# EAGLE schematic Rocket32_TRASIO (EAGLE 9.6.2)
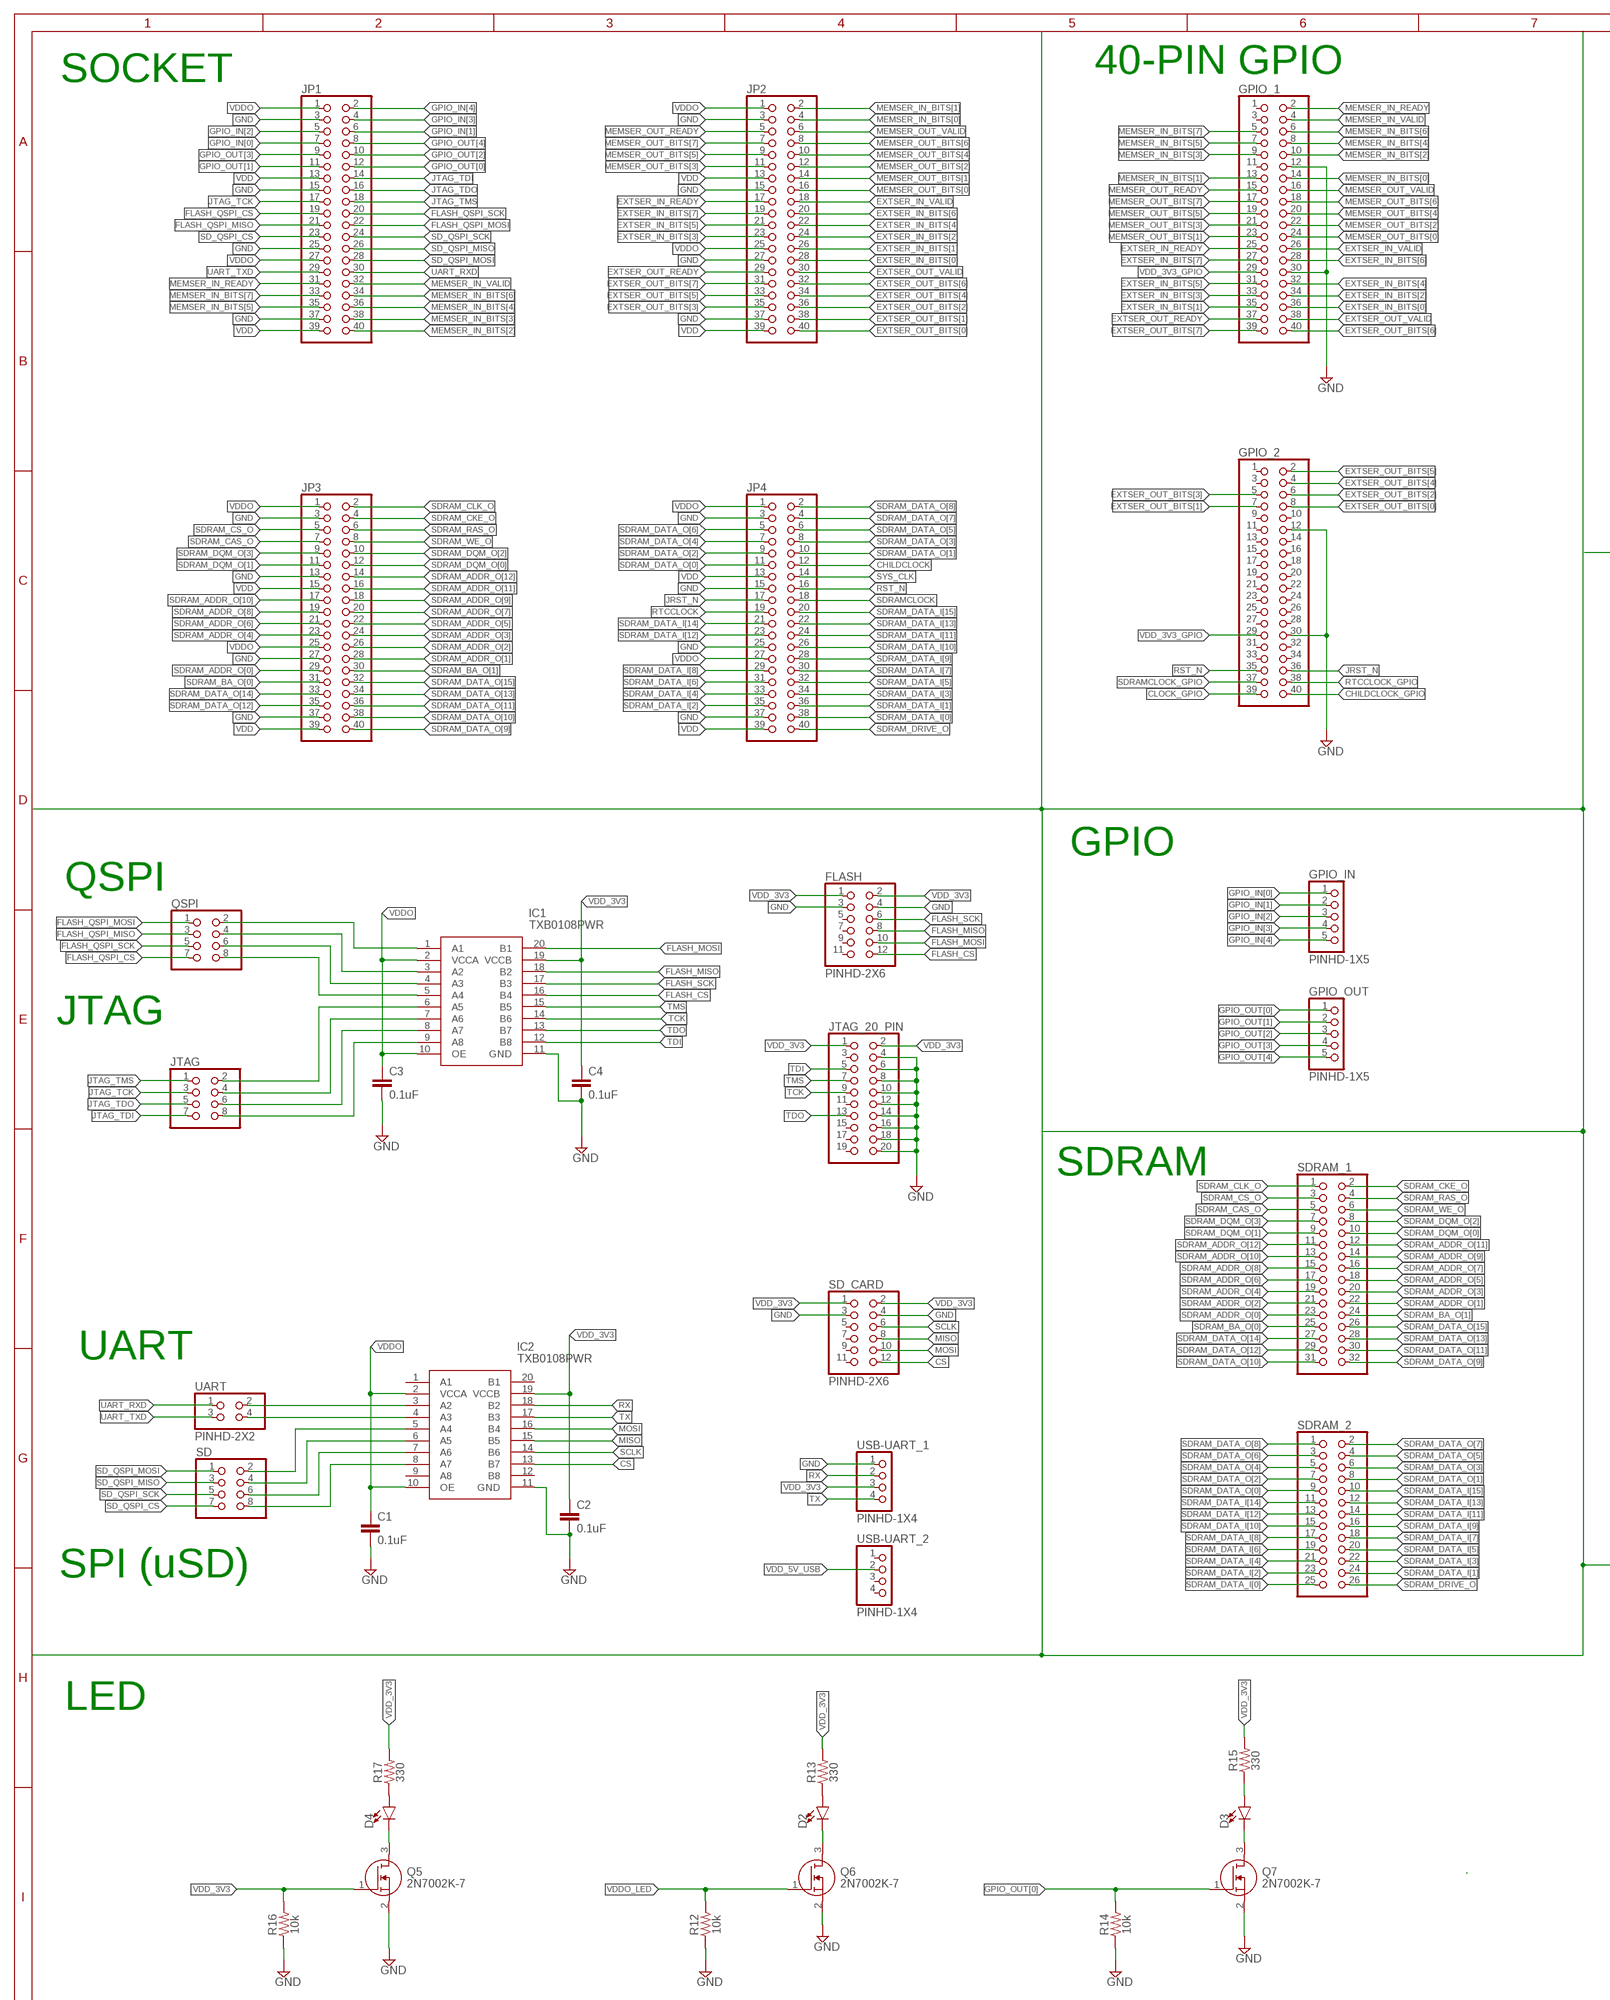
[diagram p0: schematic, sheet 1, part 1 of 2]
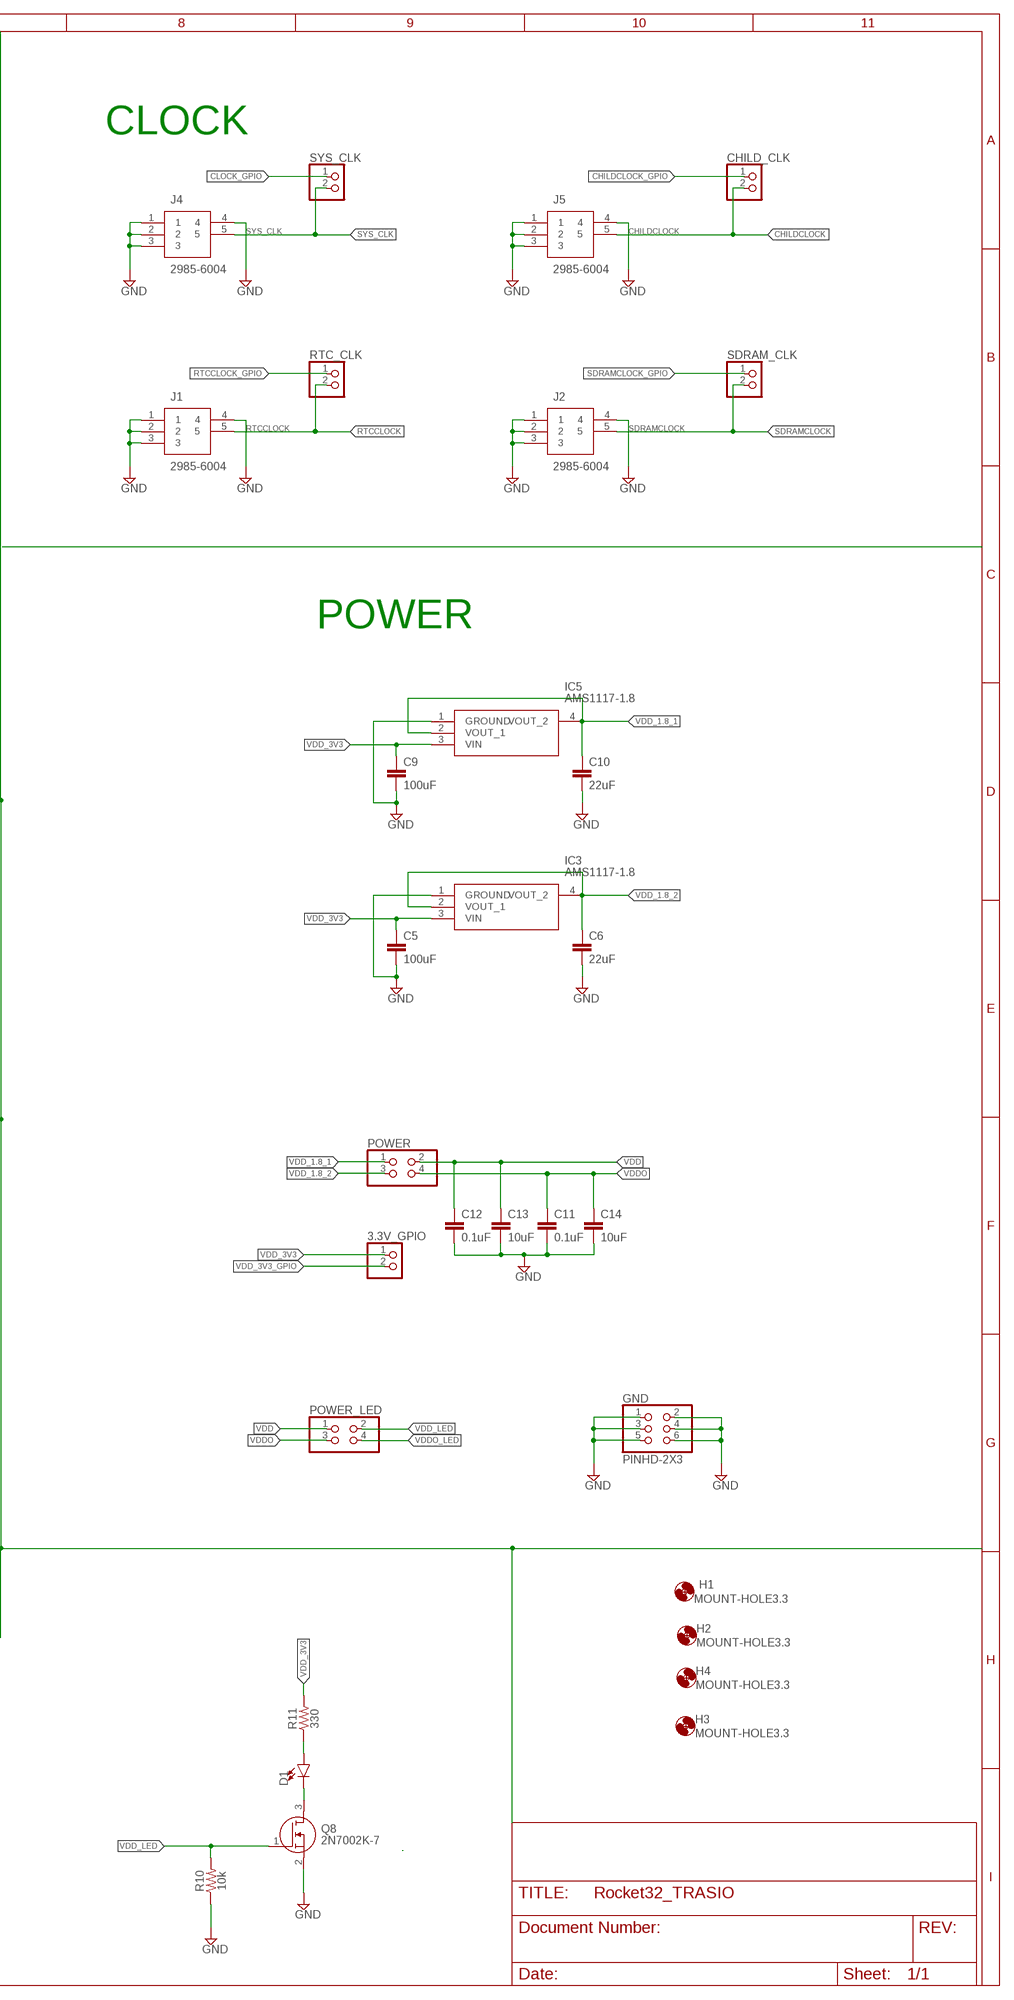
[diagram p1: schematic, sheet 1, part 2 of 2]

## Parts
3.3V_GPIO  PINHD-1X2  [1X02]
C1  0.1uF  1.0UF-1206-50V-10%  [1206]
C2  0.1uF  1.0UF-1206-50V-10%  [1206]
C3  0.1uF  1.0UF-1206-50V-10%  [1206]
C4  0.1uF  1.0UF-1206-50V-10%  [1206]
C5  100uF  1.0UF-1206-50V-10%  [1206]
C6  22uF  1.0UF-1206-50V-10%  [1206]
C9  100uF  1.0UF-1206-50V-10%  [1206]
C10  22uF  1.0UF-1206-50V-10%  [1206]
C11  0.1uF  1.0UF-1206-50V-10%  [1206]
C12  0.1uF  1.0UF-1206-50V-10%  [1206]
C13  10uF  1.0UF-1206-50V-10%  [1206]
C14  10uF  1.0UF-1206-50V-10%  [1206]
CHILD_CLK  PINHD-1X2  [1X02]
D1  LED1206  [LED-1206]
D2  LED1206  [LED-1206]
D3  LED1206  [LED-1206]
D4  LED1206  [LED-1206]
FLASH  PINHD-2X6  [2X06]
GND  PINHD-2X3  [2X03]
GPIO_1  PINHD-2X20  [2X20]
GPIO_2  PINHD-2X20  [2X20]
GPIO_IN  PINHD-1X5  [1X05]
GPIO_OUT  PINHD-1X5  [1X05]
H1  MOUNT-HOLE3.3  [3,3]
H2  MOUNT-HOLE3.3  [3,3]
H3  MOUNT-HOLE3.3  [3,3]
H4  MOUNT-HOLE3.3  [3,3]
IC1  TXB0108PWR  [SOP65P640X120-20N]
IC2  TXB0108PWR  [SOP65P640X120-20N]
IC3  AMS1117-1.8  AMS1117  [SOT229P700X180-4N]
IC5  AMS1117-1.8  AMS1117  [SOT229P700X180-4N]
J1  2985-6004  [29856004]
J2  2985-6004  [29856004]
J4  2985-6004  [29856004]
J5  2985-6004  [29856004]
JP1  PINHD-2X20  [2X20]
JP2  PINHD-2X20  [2X20]
JP3  PINHD-2X20  [2X20]
JP4  PINHD-2X20  [2X20]
JTAG  PINHD-2X4  [2X04]
JTAG_20_PIN  PINHD-2X10  [2X10]
POWER  PINHD-2X2  [2X02]
POWER_LED  PINHD-2X2  [2X02]
Q5  2N7002K-7  [SOT96P240X100-3N]
Q6  2N7002K-7  [SOT96P240X100-3N]
Q7  2N7002K-7  [SOT96P240X100-3N]
Q8  2N7002K-7  [SOT96P240X100-3N]
QSPI  PINHD-2X4  [2X04]
R10  10k  RESISTOR1206  [1206]
R11  330  RESISTOR1206  [1206]
R12  10k  RESISTOR1206  [1206]
R13  330  RESISTOR1206  [1206]
R14  10k  RESISTOR1206  [1206]
R15  330  RESISTOR1206  [1206]
R16  10k  RESISTOR1206  [1206]
R17  330  RESISTOR1206  [1206]
RTC_CLK  PINHD-1X2  [1X02]
SD  PINHD-2X4  [2X04]
SD_CARD  PINHD-2X6  [2X06]
SDRAM_1  PINHD-2X16  [2X16]
SDRAM_2  PINHD-2X13  [2X13]
SDRAM_CLK  PINHD-1X2  [1X02]
SYS_CLK  PINHD-1X2  [1X02]
UART  PINHD-2X2  [2X02]
USB-UART_1  PINHD-1X4  [1X04]
USB-UART_2  PINHD-1X4  [1X04]

## Nets
CHILDCLOCK: CHILD_CLK.2 J5.5 JP4.12
CHILDCLOCK_GPIO: CHILD_CLK.1 GPIO_2.40
CLOCK_GPIO: GPIO_2.39 SYS_CLK.1
CS: IC2.13(B7) SD_CARD.12
EXTSER_IN_BITS[0]: GPIO_1.36 JP2.28
EXTSER_IN_BITS[1]: GPIO_1.35 JP2.26
EXTSER_IN_BITS[2]: GPIO_1.34 JP2.24
EXTSER_IN_BITS[3]: GPIO_1.33 JP2.23
EXTSER_IN_BITS[4]: GPIO_1.32 JP2.22
EXTSER_IN_BITS[5]: GPIO_1.31 JP2.21
EXTSER_IN_BITS[6]: GPIO_1.28 JP2.20
EXTSER_IN_BITS[7]: GPIO_1.27 JP2.19
EXTSER_IN_READY: GPIO_1.25 JP2.17
EXTSER_IN_VALID: GPIO_1.26 JP2.18
EXTSER_OUT_BITS[0]: GPIO_2.8 JP2.40
EXTSER_OUT_BITS[1]: GPIO_2.7 JP2.38
EXTSER_OUT_BITS[2]: GPIO_2.6 JP2.36
EXTSER_OUT_BITS[3]: GPIO_2.5 JP2.35
EXTSER_OUT_BITS[4]: GPIO_2.4 JP2.34
EXTSER_OUT_BITS[5]: GPIO_2.2 JP2.33
EXTSER_OUT_BITS[6]: GPIO_1.40 JP2.32
EXTSER_OUT_BITS[7]: GPIO_1.39 JP2.31
EXTSER_OUT_READY: GPIO_1.37 JP2.29
EXTSER_OUT_VALID: GPIO_1.38 JP2.30
FLASH_CS: FLASH.12 IC1.16(B4)
FLASH_MISO: FLASH.8 IC1.18(B2)
FLASH_MOSI: FLASH.10 IC1.20(B1)
FLASH_QSPI_CS: JP1.19 QSPI.7
FLASH_QSPI_MISO: JP1.21 QSPI.3
FLASH_QSPI_MOSI: JP1.22 QSPI.1
FLASH_QSPI_SCK: JP1.20 QSPI.5
FLASH_SCK: FLASH.6 IC1.17(B3)
GND: C1.2 C2.2 C3.2 C4.2 C5.2 C6.2 C9.2 C10.2 C11.2 C12.2 C13.2 C14.2 FLASH.3 FLASH.4 GND.1 GND.2 GND.3 GND.4 GND.5 GND.6 GPIO_1.12 GPIO_1.30 GPIO_2.12 GPIO_2.30 IC1.11(GND) IC2.11(GND) IC3.1(GROUND) IC5.1(GROUND) J1.1 J1.2 J1.3 J1.4 J2.1 J2.2 J2.3 J2.4 J4.1 J4.2 J4.3 J4.4 J5.1 J5.2 J5.3 J5.4 JP1.3 JP1.15 JP1.25 JP1.37 JP2.3 JP2.15 JP2.27 JP2.37 JP3.3 JP3.13 JP3.27 JP3.37 JP4.3 JP4.15 JP4.25 JP4.37 JTAG_20_PIN.4 JTAG_20_PIN.6 JTAG_20_PIN.8 JTAG_20_PIN.10 JTAG_20_PIN.12 JTAG_20_PIN.14 JTAG_20_PIN.16 JTAG_20_PIN.18 JTAG_20_PIN.20 Q5.2(S) Q6.2(S) Q7.2(S) Q8.2(S) R10.1 R12.1 R14.1 R16.1 SD_CARD.3 SD_CARD.4 USB-UART_1.1
GPIO_IN[0]: GPIO_IN.1 JP1.7
GPIO_IN[1]: GPIO_IN.2 JP1.6
GPIO_IN[2]: GPIO_IN.3 JP1.5
GPIO_IN[3]: GPIO_IN.4 JP1.4
GPIO_IN[4]: GPIO_IN.5 JP1.2
GPIO_OUT[0]: GPIO_OUT.1 JP1.12 Q7.1(G) R14.2
GPIO_OUT[1]: GPIO_OUT.2 JP1.11
GPIO_OUT[2]: GPIO_OUT.3 JP1.10
GPIO_OUT[3]: GPIO_OUT.4 JP1.9
GPIO_OUT[4]: GPIO_OUT.5 JP1.8
JRST_N: GPIO_2.36 JP4.17
JTAG_TCK: JP1.17 JTAG.3
JTAG_TDI: JP1.14 JTAG.7
JTAG_TDO: JP1.16 JTAG.5
JTAG_TMS: JP1.18 JTAG.1
MEMSER_IN_BITS[0]: GPIO_1.14 JP2.4
MEMSER_IN_BITS[1]: GPIO_1.13 JP2.2
MEMSER_IN_BITS[2]: GPIO_1.10 JP1.40
MEMSER_IN_BITS[3]: GPIO_1.9 JP1.38
MEMSER_IN_BITS[4]: GPIO_1.8 JP1.36
MEMSER_IN_BITS[5]: GPIO_1.7 JP1.35
MEMSER_IN_BITS[6]: GPIO_1.6 JP1.34
MEMSER_IN_BITS[7]: GPIO_1.5 JP1.33
MEMSER_IN_READY: GPIO_1.2 JP1.31
MEMSER_IN_VALID: GPIO_1.4 JP1.32
MEMSER_OUT_BITS[0]: GPIO_1.24 JP2.16
MEMSER_OUT_BITS[1]: GPIO_1.23 JP2.14
MEMSER_OUT_BITS[2]: GPIO_1.22 JP2.12
MEMSER_OUT_BITS[3]: GPIO_1.21 JP2.11
MEMSER_OUT_BITS[4]: GPIO_1.20 JP2.10
MEMSER_OUT_BITS[5]: GPIO_1.19 JP2.9
MEMSER_OUT_BITS[6]: GPIO_1.18 JP2.8
MEMSER_OUT_BITS[7]: GPIO_1.17 JP2.7
MEMSER_OUT_READY: GPIO_1.15 JP2.5
MEMSER_OUT_VALID: GPIO_1.16 JP2.6
MISO: IC2.15(B5) SD_CARD.8
MOSI: IC2.16(B4) SD_CARD.10
N$1: IC1.1(A1) QSPI.2
N$2: IC1.3(A2) QSPI.4
N$3: IC1.4(A3) QSPI.6
N$5: IC1.5(A4) QSPI.8
N$6: IC2.3(A2) UART.2
N$7: IC2.4(A3) UART.4
N$8: IC1.9(A8) JTAG.8
N$9: IC1.8(A7) JTAG.6
N$10: IC1.7(A6) JTAG.4
N$11: IC1.6(A5) JTAG.2
N$12: IC2.5(A4) SD.2
N$13: IC2.6(A5) SD.4
N$14: IC2.7(A6) SD.6
N$15: IC2.8(A7) SD.8
N$17: D4.C Q5.3(D)
N$18: D2.C Q6.3(D)
N$19: D3.C Q7.3(D)
N$20: D1.C Q8.3(D)
N$26: D1.A R11.1
N$44: D2.A R13.1
N$56: D3.A R15.1
N$58: D4.A R17.1
RST_N: GPIO_2.35 JP4.16
RTCCLOCK: J1.5 JP4.19 RTC_CLK.2
RTCCLOCK_GPIO: GPIO_2.38 RTC_CLK.1
RX: IC2.18(B2) USB-UART_1.2
SCLK: IC2.14(B6) SD_CARD.6
SD_QSPI_CS: JP1.23 SD.7
SD_QSPI_MISO: JP1.26 SD.3
SD_QSPI_MOSI: JP1.28 SD.1
SD_QSPI_SCK: JP1.24 SD.5
SDRAM_ADDR_O[0]: JP3.29 SDRAM_1.23
SDRAM_ADDR_O[1]: JP3.28 SDRAM_1.22
SDRAM_ADDR_O[2]: JP3.26 SDRAM_1.21
SDRAM_ADDR_O[3]: JP3.24 SDRAM_1.20
SDRAM_ADDR_O[4]: JP3.23 SDRAM_1.19
SDRAM_ADDR_O[5]: JP3.22 SDRAM_1.18
SDRAM_ADDR_O[6]: JP3.21 SDRAM_1.17
SDRAM_ADDR_O[7]: JP3.20 SDRAM_1.16
SDRAM_ADDR_O[8]: JP3.19 SDRAM_1.15
SDRAM_ADDR_O[9]: JP3.18 SDRAM_1.14
SDRAM_ADDR_O[10]: JP3.17 SDRAM_1.13
SDRAM_ADDR_O[11]: JP3.16 SDRAM_1.12
SDRAM_ADDR_O[12]: JP3.14 SDRAM_1.11
SDRAM_BA_O[0]: JP3.31 SDRAM_1.25
SDRAM_BA_O[1]: JP3.30 SDRAM_1.24
SDRAM_CAS_O: JP3.7 SDRAM_1.5
SDRAM_CKE_O: JP3.4 SDRAM_1.2
SDRAM_CLK_O: JP3.2 SDRAM_1.1
SDRAM_CS_O: JP3.5 SDRAM_1.3
SDRAM_DATA_I[0]: JP4.38 SDRAM_2.25
SDRAM_DATA_I[1]: JP4.36 SDRAM_2.24
SDRAM_DATA_I[2]: JP4.35 SDRAM_2.23
SDRAM_DATA_I[3]: JP4.34 SDRAM_2.22
SDRAM_DATA_I[4]: JP4.33 SDRAM_2.21
SDRAM_DATA_I[5]: JP4.32 SDRAM_2.20
SDRAM_DATA_I[6]: JP4.31 SDRAM_2.19
SDRAM_DATA_I[7]: JP4.30 SDRAM_2.18
SDRAM_DATA_I[8]: JP4.29 SDRAM_2.17
SDRAM_DATA_I[9]: JP4.28 SDRAM_2.16
SDRAM_DATA_I[10]: JP4.26 SDRAM_2.15
SDRAM_DATA_I[11]: JP4.24 SDRAM_2.14
SDRAM_DATA_I[12]: JP4.23 SDRAM_2.13
SDRAM_DATA_I[13]: JP4.22 SDRAM_2.12
SDRAM_DATA_I[14]: JP4.21 SDRAM_2.11
SDRAM_DATA_I[15]: JP4.20 SDRAM_2.10
SDRAM_DATA_O[0]: JP4.11 SDRAM_2.9
SDRAM_DATA_O[1]: JP4.10 SDRAM_2.8
SDRAM_DATA_O[2]: JP4.9 SDRAM_2.7
SDRAM_DATA_O[3]: JP4.8 SDRAM_2.6
SDRAM_DATA_O[4]: JP4.7 SDRAM_2.5
SDRAM_DATA_O[5]: JP4.6 SDRAM_2.4
SDRAM_DATA_O[6]: JP4.5 SDRAM_2.3
SDRAM_DATA_O[7]: JP4.4 SDRAM_2.2
SDRAM_DATA_O[8]: JP4.2 SDRAM_2.1
SDRAM_DATA_O[9]: JP3.40 SDRAM_1.32
SDRAM_DATA_O[10]: JP3.38 SDRAM_1.31
SDRAM_DATA_O[11]: JP3.36 SDRAM_1.30
SDRAM_DATA_O[12]: JP3.35 SDRAM_1.29
SDRAM_DATA_O[13]: JP3.34 SDRAM_1.28
SDRAM_DATA_O[14]: JP3.33 SDRAM_1.27
SDRAM_DATA_O[15]: JP3.32 SDRAM_1.26
SDRAM_DQM_O[0]: JP3.12 SDRAM_1.10
SDRAM_DQM_O[1]: JP3.11 SDRAM_1.9
SDRAM_DQM_O[2]: JP3.10 SDRAM_1.8
SDRAM_DQM_O[3]: JP3.9 SDRAM_1.7
SDRAM_DRIVE_O: JP4.40 SDRAM_2.26
SDRAM_RAS_O: JP3.6 SDRAM_1.4
SDRAM_WE_O: JP3.8 SDRAM_1.6
SDRAMCLOCK: J2.5 JP4.18 SDRAM_CLK.2
SDRAMCLOCK_GPIO: GPIO_2.37 SDRAM_CLK.1
SYS_CLK: J4.5 JP4.14 SYS_CLK.2
TCK: IC1.14(B6) JTAG_20_PIN.9
TDI: IC1.12(B8) JTAG_20_PIN.5
TDO: IC1.13(B7) JTAG_20_PIN.13
TMS: IC1.15(B5) JTAG_20_PIN.7
TX: IC2.17(B3) USB-UART_1.4
UART_RXD: JP1.30 UART.1
UART_TXD: JP1.29 UART.3
VDD: C12.1 C13.1 JP1.13 JP1.39 JP2.13 JP2.39 JP3.15 JP3.39 JP4.13 JP4.39 POWER.2 POWER_LED.1
VDD_1.8_1: C10.1 IC5.2(VOUT_1) IC5.4(VOUT_2) POWER.1
VDD_1.8_2: C6.1 IC3.2(VOUT_1) IC3.4(VOUT_2) POWER.3
VDD_3V3: 3.3V_GPIO.1 C2.1 C4.1 C5.1 C9.1 FLASH.1 FLASH.2 IC1.19(VCCB) IC2.19(VCCB) IC3.3(VIN) IC5.3(VIN) JTAG_20_PIN.1 JTAG_20_PIN.2 Q5.1(G) R11.2 R13.2 R15.2 R16.2 R17.2 SD_CARD.1 SD_CARD.2 USB-UART_1.3
VDD_3V3_GPIO: 3.3V_GPIO.2 GPIO_1.29 GPIO_2.29
VDD_5V_USB: USB-UART_2.2
VDD_LED: POWER_LED.2 Q8.1(G) R10.2
VDDO: C1.1 C3.1 C11.1 C14.1 IC1.2(VCCA) IC1.10(OE) IC2.2(VCCA) IC2.10(OE) JP1.1 JP1.27 JP2.1 JP2.25 JP3.1 JP3.25 JP4.1 JP4.27 POWER.4 POWER_LED.3
VDDO_LED: POWER_LED.4 Q6.1(G) R12.2
Unconnected: FLASH.5 FLASH.7 FLASH.9 FLASH.11 GPIO_1.1 GPIO_1.3 GPIO_1.11 GPIO_2.1 GPIO_2.3 GPIO_2.9 GPIO_2.10 GPIO_2.11 GPIO_2.13 GPIO_2.14 GPIO_2.15 GPIO_2.16 GPIO_2.17 GPIO_2.18 GPIO_2.19 GPIO_2.20 GPIO_2.21 GPIO_2.22 GPIO_2.23 GPIO_2.24 GPIO_2.25 GPIO_2.26 GPIO_2.27 GPIO_2.28 GPIO_2.31 GPIO_2.32 GPIO_2.33 GPIO_2.34 IC2.1(A1) IC2.9(A8) IC2.12(B8) IC2.20(B1) JTAG_20_PIN.3 JTAG_20_PIN.11 JTAG_20_PIN.15 JTAG_20_PIN.17 JTAG_20_PIN.19 SD_CARD.5 SD_CARD.7 SD_CARD.9 SD_CARD.11 USB-UART_2.1 USB-UART_2.3 USB-UART_2.4

## Notes on the sheet
- SOCKET | 40-PIN GPIO
- CLOCK
- POWER
- GPIO
- QSPI
- JTAG
- SDRAM
- UART
- SPI (uSD)
- LED

## Library data of the parts
3.3V_GPIO CHILD_CLK RTC_CLK SDRAM_CLK SYS_CLK = pinhead:PINHD-1X2: PIN HEADER
C1-C6 C9-C14 = SparkFun-Capacitors:1.0UF: 1µF ceramic capacitors A capacitor is a passive two-terminal electrical component used to store electrical energy temporarily in an electric field.; PROD_ID: CAP-09822; VALUE: 1.0uF
D1-D4 = SparkFun-LED:LED: LED (Generic) Standard schematic elements and footprints for 5mm, 3mm, 1206, and 0603 sized LEDs. Generic LEDs with no color specified.
FLASH SD_CARD = Connector:PINHD-2X6: PIN HEADER; CATEGORY: CONNECTOR; SUB-CATEGORY: PIN-HEADER
GND = Connector:PINHD-2X3: PIN HEADER; CATEGORY: CONNECTOR; SUB-CATEGORY: PIN-HEADER
GPIO_1 GPIO_2 JP1-JP4 = adafruit:PINHD-2X20: PIN HEADER
GPIO_IN GPIO_OUT = Connector:PINHD-1X5: PIN HEADER; CATEGORY: CONNECTOR; SUB-CATEGORY: PIN-HEADER
H1-H4 = holes:MOUNT-HOLE: MOUNTING HOLE with drill center marker
IC1 IC2 = SamacSys_Parts:TXB0108PWR: 8-Bit Bidirectional Voltage-Level Shifter with Auto Direction Sensing and +/-15-kV ESD Protect Source: Datasheet <http://www.ti.com/lit/ds/symlink/txb0108.pdf>; ARROW_PART_NUMBER: TXB0108PWR; ARROW_PRICE-STOCK: https://www.arrow.com/en/products/txb0108pwr/texas-instruments?region=nac; DESCRIPTION: 8-Bit Bidirectional Voltage-Level Shifter with Auto Direction Sensing and +/-15-kV ESD Protect; HEIGHT: 1.2mm; MANUFACTURER_NAME: Texas Instruments; MANUFACTURER_PART_NUMBER: TXB0108PWR; MOUSER_PART_NUMBER: 595-TXB0108PWR; MOUSER_PRICE-STOCK: https://www.mouser.co.uk/ProductDetail/Texas-Instruments/TXB0108PWR?qs=oFXvjAmG9EgEUWGWzOVFCA%3D%3D
IC3 IC5 = SamacSys_Parts:AMS1117: 1117 Source: Datasheet <https://datasheet.lcsc.com/szlcsc/Advanced-Monolithic-Systems-AMS-AMS1117-ADJ_C6188.pdf>; DESCRIPTION: 1117; HEIGHT: 1.8mm; MANUFACTURER_NAME: Advanced Monolithic Systems; MANUFACTURER_PART_NUMBER: AMS1117
J1 J2 J4 J5 = SamacSys_Parts:2985-6004: RF Connectors / Coaxial Connectors SMA F PCB Thru-Hole Conn, 50-OHMS 1000 Source: Datasheet <https://componentsearchengine.com//2985-6004.pdf>; DESCRIPTION: RF Connectors / Coaxial Connectors SMA F PCB Thru-Hole Conn, 50-OHMS 1000; HEIGHT: 9.54mm; MANUFACTURER_NAME: Amphenol; MANUFACTURER_PART_NUMBER: 2985-6004; MOUSER_PART_NUMBER: 523-2985-6004; MOUSER_PRICE-STOCK: https://www.mouser.co.uk/ProductDetail/Amphenol-SV-Microwave/2985-6004?qs=jyo2EwfRkUNkt8LGijRXFQ%3D%3D
JTAG QSPI SD = adafruit:PINHD-2X4: PIN HEADER
JTAG_20_PIN = pinhead:PINHD-2X10: PIN HEADER
POWER POWER_LED = pinhead:PINHD-2X2: PIN HEADER
Q5-Q8 = SamacSys_Parts:2N7002K-7: N-CHANNEL ENHANCEMENT MODE MOSFET Source: Datasheet <https://www.diodes.com/assets/Datasheets/ds30896.pdf>; ARROW_PART_NUMBER: 2N7002K-7; ARROW_PRICE-STOCK: https://www.arrow.com/en/products/2n7002k-7/diodes-incorporated; DESCRIPTION: N-CHANNEL ENHANCEMENT MODE MOSFET; HEIGHT: 1mm; MANUFACTURER_NAME: Diodes Inc.; MANUFACTURER_PART_NUMBER: 2N7002K-7; MOUSER_PART_NUMBER: 621-2N7002K-7; MOUSER_PRICE-STOCK: https://www.mouser.co.uk/ProductDetail/Diodes-Incorporated/2N7002K-7?qs=rGAXPo9uwV0%2Fp9r5KJ7huA%3D%3D
R10-R17 = SparkFun-Resistors:RESISTOR: Generic Resistor Package
SDRAM_1 = pinhead:PINHD-2X16: PIN HEADER
SDRAM_2 = pinhead:PINHD-2X13: PIN HEADER
UART = Connector:PINHD-2X2: PIN HEADER; CATEGORY: CONNECTOR; SUB-CATEGORY: PIN-HEADER
USB-UART_1 USB-UART_2 = Connector:PINHD-1X4: PIN HEADER; CATEGORY: CONNECTOR; SUB-CATEGORY: PIN-HEADER